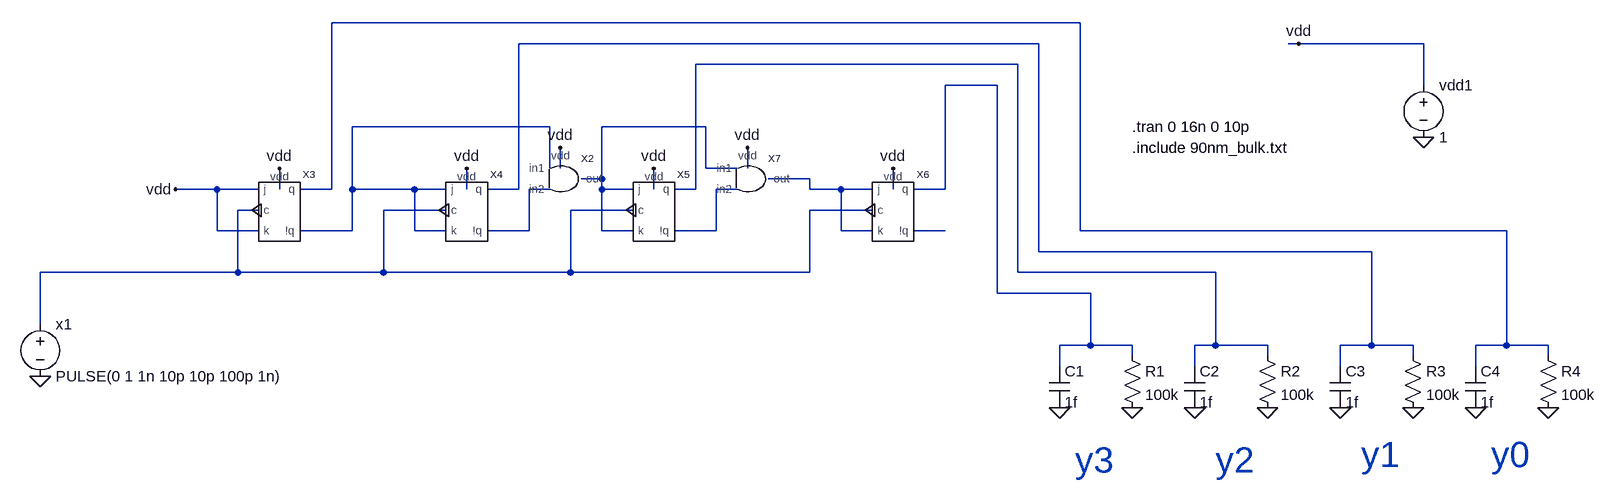
[diagram p0: schematic decCounter-embedded-test.asc]
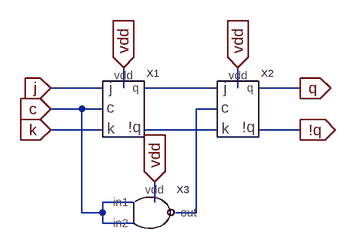
[diagram p1: sub-circuit jk-front-trigger.asc]
decCounter-embedded-test.asc, the LTspice schematic file:
Version 4
SHEET 1 4180 1316
WIRE 1536 -240 384 -240
WIRE 1472 -208 672 -208
WIRE 1872 -208 1856 -208
WIRE 2064 -208 1872 -208
WIRE 1440 -176 944 -176
WIRE 1408 -144 1328 -144
WIRE 2064 -144 2064 -208
WIRE 720 -80 416 -80
WIRE 960 -80 800 -80
WIRE 720 -16 720 -80
WIRE 736 -16 736 -48
WIRE 960 -16 960 -80
WIRE 1008 -16 960 -16
WIRE 1024 -16 1024 -48
WIRE 800 0 800 -80
WIRE 800 0 768 0
WIRE 1120 0 1056 0
WIRE 208 16 144 16
WIRE 272 16 208 16
WIRE 304 16 304 -16
WIRE 384 16 384 -240
WIRE 384 16 336 16
WIRE 416 16 416 -80
WIRE 512 16 416 16
WIRE 560 16 512 16
WIRE 592 16 592 -16
WIRE 672 16 672 -208
WIRE 672 16 624 16
WIRE 720 16 688 16
WIRE 800 16 800 0
WIRE 848 16 800 16
WIRE 880 16 880 -16
WIRE 944 16 944 -176
WIRE 944 16 912 16
WIRE 1008 16 976 16
WIRE 1120 16 1120 0
WIRE 1168 16 1120 16
WIRE 1216 16 1168 16
WIRE 1248 16 1248 -16
WIRE 1328 16 1328 -144
WIRE 1328 16 1280 16
WIRE 272 48 240 48
WIRE 560 48 464 48
WIRE 848 48 752 48
WIRE 1216 48 1120 48
WIRE 208 80 208 16
WIRE 272 80 208 80
WIRE 416 80 416 16
WIRE 416 80 336 80
WIRE 512 80 512 16
WIRE 560 80 512 80
WIRE 688 80 688 16
WIRE 688 80 624 80
WIRE 800 80 800 16
WIRE 848 80 800 80
WIRE 976 80 976 16
WIRE 976 80 912 80
WIRE 1168 80 1168 16
WIRE 1216 80 1168 80
WIRE 1328 80 1280 80
WIRE 1536 80 1536 -240
WIRE 2192 80 1536 80
WIRE 1472 112 1472 -208
WIRE 1984 112 1472 112
WIRE 240 144 240 48
WIRE 240 144 -64 144
WIRE 464 144 464 48
WIRE 464 144 240 144
WIRE 752 144 752 48
WIRE 752 144 464 144
WIRE 1120 144 1120 48
WIRE 1120 144 752 144
WIRE 1440 144 1440 -176
WIRE 1744 144 1440 144
WIRE 1408 176 1408 -144
WIRE 1552 176 1408 176
WIRE -64 224 -64 144
WIRE 1552 256 1552 176
WIRE 1552 256 1504 256
WIRE 1616 256 1552 256
WIRE 1744 256 1744 144
WIRE 1744 256 1712 256
WIRE 1824 256 1744 256
WIRE 1984 256 1984 112
WIRE 1984 256 1936 256
WIRE 2048 256 1984 256
WIRE 2192 256 2192 80
WIRE 2192 256 2144 256
WIRE 2256 256 2192 256
WIRE 1616 272 1616 256
WIRE 1824 272 1824 256
WIRE 2048 272 2048 256
WIRE 2256 272 2256 256
WIRE 1504 288 1504 256
WIRE 1712 288 1712 256
WIRE 1936 288 1936 256
WIRE 2144 288 2144 256
FLAG -64 304 0
FLAG 2064 -64 0
FLAG 1504 352 0
FLAG 1616 352 0
FLAG 1712 352 0
FLAG 1824 352 0
FLAG 1936 352 0
FLAG 2048 352 0
FLAG 2144 352 0
FLAG 2256 352 0
FLAG 1248 -16 vdd
FLAG 592 -16 vdd
FLAG 304 -16 vdd
FLAG 880 -16 vdd
FLAG 1872 -208 vdd
FLAG 144 16 vdd
FLAG 736 -48 vdd
FLAG 1024 -48 vdd
SYMBOL voltage -64 208 R0
WINDOW 123 0 0 Left 2
WINDOW 39 0 0 Left 2
SYMATTR InstName x1
SYMATTR Value PULSE(0 1 1n 10p 10p 100p 1n)
SYMBOL voltage 2064 -160 R0
WINDOW 123 0 0 Left 2
WINDOW 39 0 0 Left 2
SYMATTR InstName vdd1
SYMATTR Value 1
SYMBOL res 1600 256 R0
SYMATTR InstName R1
SYMATTR Value 100k
SYMBOL cap 1488 288 R0
SYMATTR InstName C1
SYMATTR Value 1f
SYMBOL res 1808 256 R0
SYMATTR InstName R2
SYMATTR Value 100k
SYMBOL cap 1696 288 R0
SYMATTR InstName C2
SYMATTR Value 1f
SYMBOL res 2032 256 R0
SYMATTR InstName R3
SYMATTR Value 100k
SYMBOL cap 1920 288 R0
SYMATTR InstName C3
SYMATTR Value 1f
SYMBOL res 2240 256 R0
SYMATTR InstName R4
SYMATTR Value 100k
SYMBOL cap 2128 288 R0
SYMATTR InstName C4
SYMATTR Value 1f
SYMBOL jk-front-trigger 304 48 R0
SYMATTR InstName X3
SYMBOL jk-front-trigger 592 48 R0
SYMATTR InstName X4
SYMBOL jk-front-trigger 880 48 R0
SYMATTR InstName X5
SYMBOL jk-front-trigger 1248 48 R0
SYMATTR InstName X6
SYMBOL and 736 0 R0
SYMATTR InstName X2
SYMBOL and 1024 0 R0
SYMATTR InstName X7
TEXT 1616 -48 Left 2 !.include 90nm_bulk.txt
TEXT 1616 -80 Left 2 !.tran 0 16n 0 10p
TEXT 2168 424 Left 5 ;y0
TEXT 1968 424 Left 5 ;y1
TEXT 1744 432 Left 5 ;y2
TEXT 1528 432 Left 5 ;y3

jk-front-trigger.asc, the sub-circuit schematic file:
Version 4
SHEET 1 880 680
WIRE 48 128 -32 128
WIRE 80 128 80 96
WIRE 224 128 112 128
WIRE 256 128 256 96
WIRE 352 128 288 128
WIRE 16 160 -32 160
WIRE 48 160 16 160
WIRE 224 160 192 160
WIRE 48 192 -32 192
WIRE 224 192 112 192
WIRE 352 192 288 192
WIRE 96 304 48 304
WIRE 128 304 128 272
WIRE 16 320 16 160
WIRE 48 320 48 304
WIRE 48 320 16 320
WIRE 192 320 192 160
WIRE 192 320 160 320
WIRE 48 336 48 320
WIRE 96 336 48 336
FLAG 256 96 vdd
IOPIN 256 96 In
FLAG 80 96 vdd
IOPIN 80 96 In
FLAG 352 128 q
IOPIN 352 128 Out
FLAG 352 192 !q
IOPIN 352 192 Out
FLAG -32 128 j
IOPIN -32 128 In
FLAG -32 192 k
IOPIN -32 192 In
FLAG -32 160 c
IOPIN -32 160 In
FLAG 128 272 vdd
IOPIN 128 272 In
SYMBOL jk-trigger 80 160 R0
SYMATTR InstName X1
SYMBOL jk-trigger 256 160 R0
SYMATTR InstName X2
SYMBOL nand 112 320 R0
SYMATTR InstName X3

The netlist it stands for:
* decCounter-embedded-test.asc
V§x1 N010 0 PULSE(0 1 1n 10p 10p 100p 1n)
vdd1 vdd 0 1
R1 N004 0 100k
C1 N004 0 1f
R2 N003 0 100k
C2 N003 0 1f
R3 N002 0 100k
C3 N002 0 1f
R4 N001 0 100k
C4 N001 0 1f
XX3 vdd N010 vdd N001 N005 vdd jk-front-trigger
XX4 N005 N010 N005 N002 N008 vdd jk-front-trigger
XX5 N006 N010 N006 N003 N009 vdd jk-front-trigger
XX6 N007 N010 N007 N004 N011 vdd jk-front-trigger
XX2 N005 N008 vdd N006 and  ; pins in1 in2 vdd out
XX7 N006 N009 vdd N007 and  ; pins in1 in2 vdd out

* block symbol definitions
.subckt jk-front-trigger j c k q !q vdd
XX1 k c j vdd N003 N001 jk-trigger  ; pins k c j vdd !q q
XX2 N003 N002 N001 vdd !q q jk-trigger  ; pins k c j vdd !q q
XX3 c c N002 vdd nand  ; pins in1 in2 out vdd
.ends jk-front-trigger

.include 90nm_bulk.txt
.tran 0 16n 0 10p
* y0
* y1
* y2
* y3
.backanno
.end